# Altium schematic sheet PSU_LM2704_16V5.SchDoc: PSU LM2704 16V5
size A4; Organization: Altium Limited.; Address1: Level 3, 12a Rodborough Rd; Address2: Frenchs Forest 2086; Address3: NSW; Address4: AUSTRALIA; Revision: 6; SheetNumber: 36; SheetTotal: 64; PageSetup: Record=PageOptions|CenterHorizontal=True|CenterVertical=True|PrintScale=0.97|XCorrection=1.00|YCorrection=1.00|PrintKind=0|BorderSize=5000000|LeftOffset=0|BottomOffset=0|Orientation=2|PaperLength=1000|PaperWidth=1000|Scale=100|PaperSource=7|PrintQuality=1200|MediaType=1|DitherType=10|PaperKind=A4 (210 x 297 mm)|PrintScaleMode=1
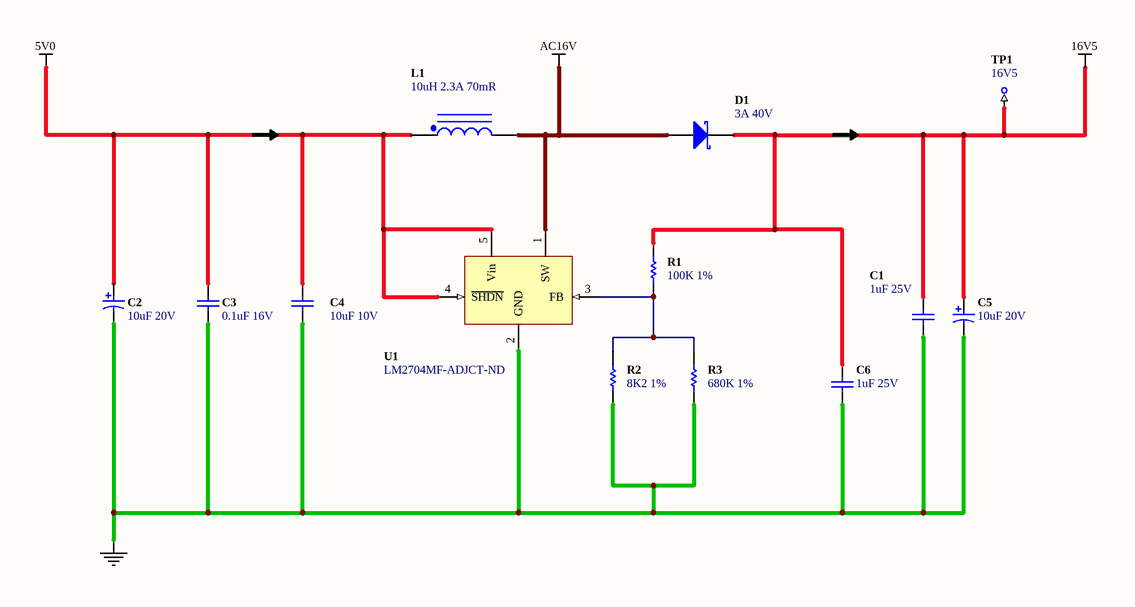
[diagram p0: PSU_LM2704_16V5.SchDoc]

## Parts
C1  1uF 25V  [CAPC3216-STAR]
C2  10uF 20V  [CAPC3528-STAR]
C3  0.1uF 16V  [CAPC1005-STAR]
C4  10uF 10V  [CAPC2012-STAR]
C5  10uF 20V  [CAPC3528-STAR]
C6  1uF 25V  [CAPC3216-STAR]
D1  3A 40V  [DIOM5027]
L1  10uH 2.3A 70mR  [INDP7575]
R1  100K 1%  [RESC1005-STAR]
R2  8K2 1%  [RESC1005-STAR]
R3  680K 1%  [RESC1005-STAR]
TP1  16V5  [TestPin]  (no BOM)
U1  LM2704MF-ADJCT-ND  [SOT95P284-5]

## Nets
5V0: C2.1 C3.1 C4.2 L1.1 U1.4(~{SHDN}) U1.5(Vin)
16V5: C1.2 C5.1 C6.2 D1.2(K) R1.2 TP1.1
AC16V: D1.1(A) L1.2 U1.1(SW)
GND: C1.1 C2.2 C3.2 C4.1 C5.2 C6.1 R2.1 R3.1 U1.2(GND)
NetR1_1: R1.1 R2.2 R3.2 U1.3(FB)

## Notes on the sheet
- Sheet Title
- Project Title
- Size:
- Date:
- A4
- Assy:
- Time:
- Sheet
- Revision:
- of
- File:

## Library data of the parts
C1 C6 = D-101-0027: Capacitor, Ceramic, 1uF 10% 25V 1206 (3216) X7R; Polarity: Non-Polarized; Category: Capacitor; Capacitance: 1 uF; Dielectric: X7R; Mounting Technology: Surface Mount; Rated Voltage: 25 V; Status: Production; Technology: Ceramic; Tolerance: 10 %
C2 C5 = D-101-0007: Capacitor, Tantalum, 10uF 10% 20V MCCT-B (3528); Polarity: Polarized; Category: Capacitor; Capacitance: 10 uF; Mounting Technology: Surface Mount; Rated Voltage: 20 V; Status: Production; Technology: Tantalum; Tolerance: 10 %
C3 = D-101-0080: Capacitor, Ceramic, 0.1uF 10% 16V 0402 (1005) X7R; Polarity: Non-Polarized; Category: Capacitor; Capacitance: 0.1 uF; Dielectric: X7R; Mounting Technology: Surface Mount; Rated Voltage: 16 V; Status: Production; Technology: Ceramic; Tolerance: 10 %
C4 = D-101-0087: Capacitor, Ceramic, 10uF 10% 10V 0805 (2012) X5R; Polarity: Non-Polarized; Category: Capacitor; Capacitance: 10 uF; Dielectric: X5R; Mounting Technology: Surface Mount; Rated Voltage: 10 V; Status: Unreleased; Technology: None; Tolerance: 10 %
D1 = D-151-0000: Schottky Diode, 3A 40V; Category: Diode-Schottky; Status: Production
L1 = D-102-0001: Inductor, Magnetic Core 10uH 2.3A 70mR INDP7575; Category: Inductor; Status: Production
R1 = D-100-0132: Resistor, 100K 1% 0402 (1005); Power Rating: 63 mW; Category: Resistor; Mounting Technology: Surface Mount; Resistance: 100 K; Status: Production; Tolerance: 1 %
R2 = D-100-0074: Resistor, 8K2 1% 0402 (1005); Power Rating: 63 mW; Resistance: 8.2 K; Category: Resistor; Mounting Technology: Surface Mount; Status: Production; Tolerance: 1 %
R3 = D-100-0084: Resistor, 680K 1% 0402 (1005); Power Rating: 63 mW; Category: Resistor; Mounting Technology: Surface Mount; Resistance: 680 K; Status: Production; Tolerance: 1 %
TP1 = D-006-0000: Test Point, PCB Mount with Silkscreen Box; Category: Test-Point; Status: Production
U1 = D-204-0003: LM2704MF, Micropower Step-up DC/DC Converter, 550mA Peak Current Limit, 2.2-7V Input, 20V Max Output; Category: IC-Power; Status: Production